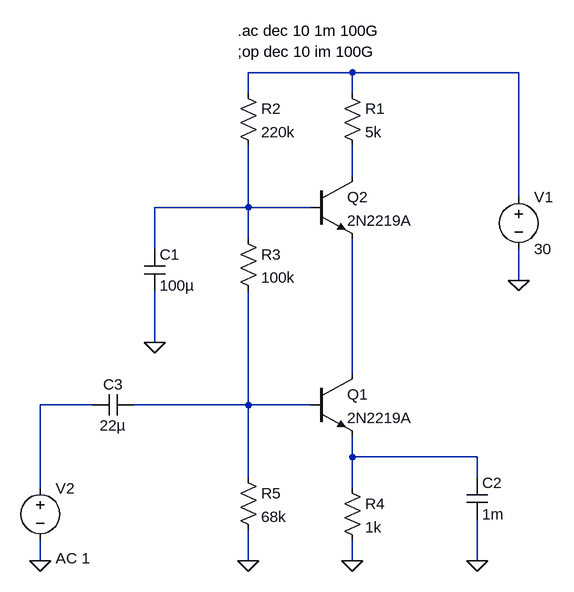
[diagram p0: schematic Full Circuit.asc]
Full Circuit.asc, the LTspice schematic file:
Version 4
SHEET 1 880 680
WIRE 384 -128 224 -128
WIRE 640 -128 384 -128
WIRE 224 -96 224 -128
WIRE 384 -96 384 -128
WIRE 384 32 384 -16
WIRE 640 64 640 -128
WIRE 224 80 224 -16
WIRE 224 80 80 80
WIRE 320 80 224 80
WIRE 224 128 224 80
WIRE 80 144 80 80
WIRE 640 192 640 144
WIRE 80 288 80 208
WIRE 384 336 384 128
WIRE -16 384 -96 384
WIRE 224 384 224 208
WIRE 224 384 48 384
WIRE 320 384 224 384
WIRE 384 464 384 432
WIRE 576 464 384 464
WIRE 224 496 224 384
WIRE 576 496 576 464
WIRE -96 512 -96 384
WIRE 384 512 384 464
WIRE -96 624 -96 592
WIRE 224 624 224 576
WIRE 384 624 384 592
WIRE 576 624 576 560
FLAG 80 288 0
FLAG 640 192 0
FLAG -96 624 0
FLAG 224 624 0
FLAG 384 624 0
FLAG 576 624 0
SYMBOL cap 64 144 R0
SYMATTR InstName C1
SYMATTR Value 100µ
SYMBOL res 208 -112 R0
SYMATTR InstName R2
SYMATTR Value 220k
SYMBOL res 208 112 R0
SYMATTR InstName R3
SYMATTR Value 100k
SYMBOL voltage 640 48 R0
WINDOW 123 0 0 Left 0
WINDOW 39 0 0 Left 0
SYMATTR InstName V1
SYMATTR Value 30
SYMBOL npn 320 32 R0
SYMATTR InstName Q2
SYMATTR Value 2N2219A
SYMBOL res 368 -112 R0
SYMATTR InstName R1
SYMATTR Value 5k
SYMBOL cap 560 496 R0
SYMATTR InstName C2
SYMATTR Value 1m
SYMBOL cap 48 368 R90
WINDOW 0 0 32 VBottom 2
WINDOW 3 32 32 VTop 2
SYMATTR InstName C3
SYMATTR Value 22µ
SYMBOL voltage -96 496 R0
WINDOW 123 24 124 Left 2
WINDOW 39 0 0 Left 0
SYMATTR InstName V2
SYMATTR Value ""
SYMATTR Value2 AC 1
SYMBOL res 368 496 R0
SYMATTR InstName R4
SYMATTR Value 1k
SYMBOL res 208 480 R0
SYMATTR InstName R5
SYMATTR Value 68k
SYMBOL npn 320 336 R0
SYMATTR InstName Q1
SYMATTR Value 2N2219A
TEXT 208 -192 Left 2 !.ac dec 10 1m 100G
TEXT 208 -160 Left 2 !;op dec 10 im 100G

The netlist it stands for:
* Full Circuit.asc
C1 N003 0 100µ
R2 N001 N003 220k
R3 N003 N006 100k
V1 N001 0 30
Q2 N002 N003 N004 0 2N2219A
R1 N001 N002 5k
C2 N007 0 1m
C3 N006 N005 22µ
V2 N005 0 AC 1
R4 N007 0 1k
R5 N006 0 68k
Q1 N004 N006 N007 0 2N2219A
.model NPN NPN
.model PNP PNP
.lib standard.bjt
.ac dec 10 1m 100G
;op dec 10 im 100G
.backanno
.end